# EAGLE design RS485-LoRa Wireless Station V1.3 (EAGLE 6.1)
COMPANY: ADAFRUIT INDUSTRIES; DRAWN: KTOWN; REV: B
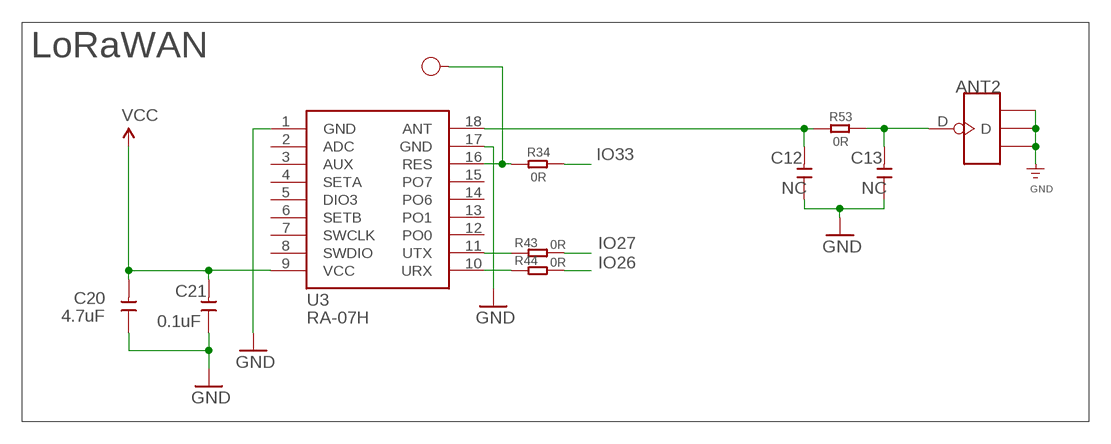
[diagram p0: schematic, sheet 1, part 1 of 3]
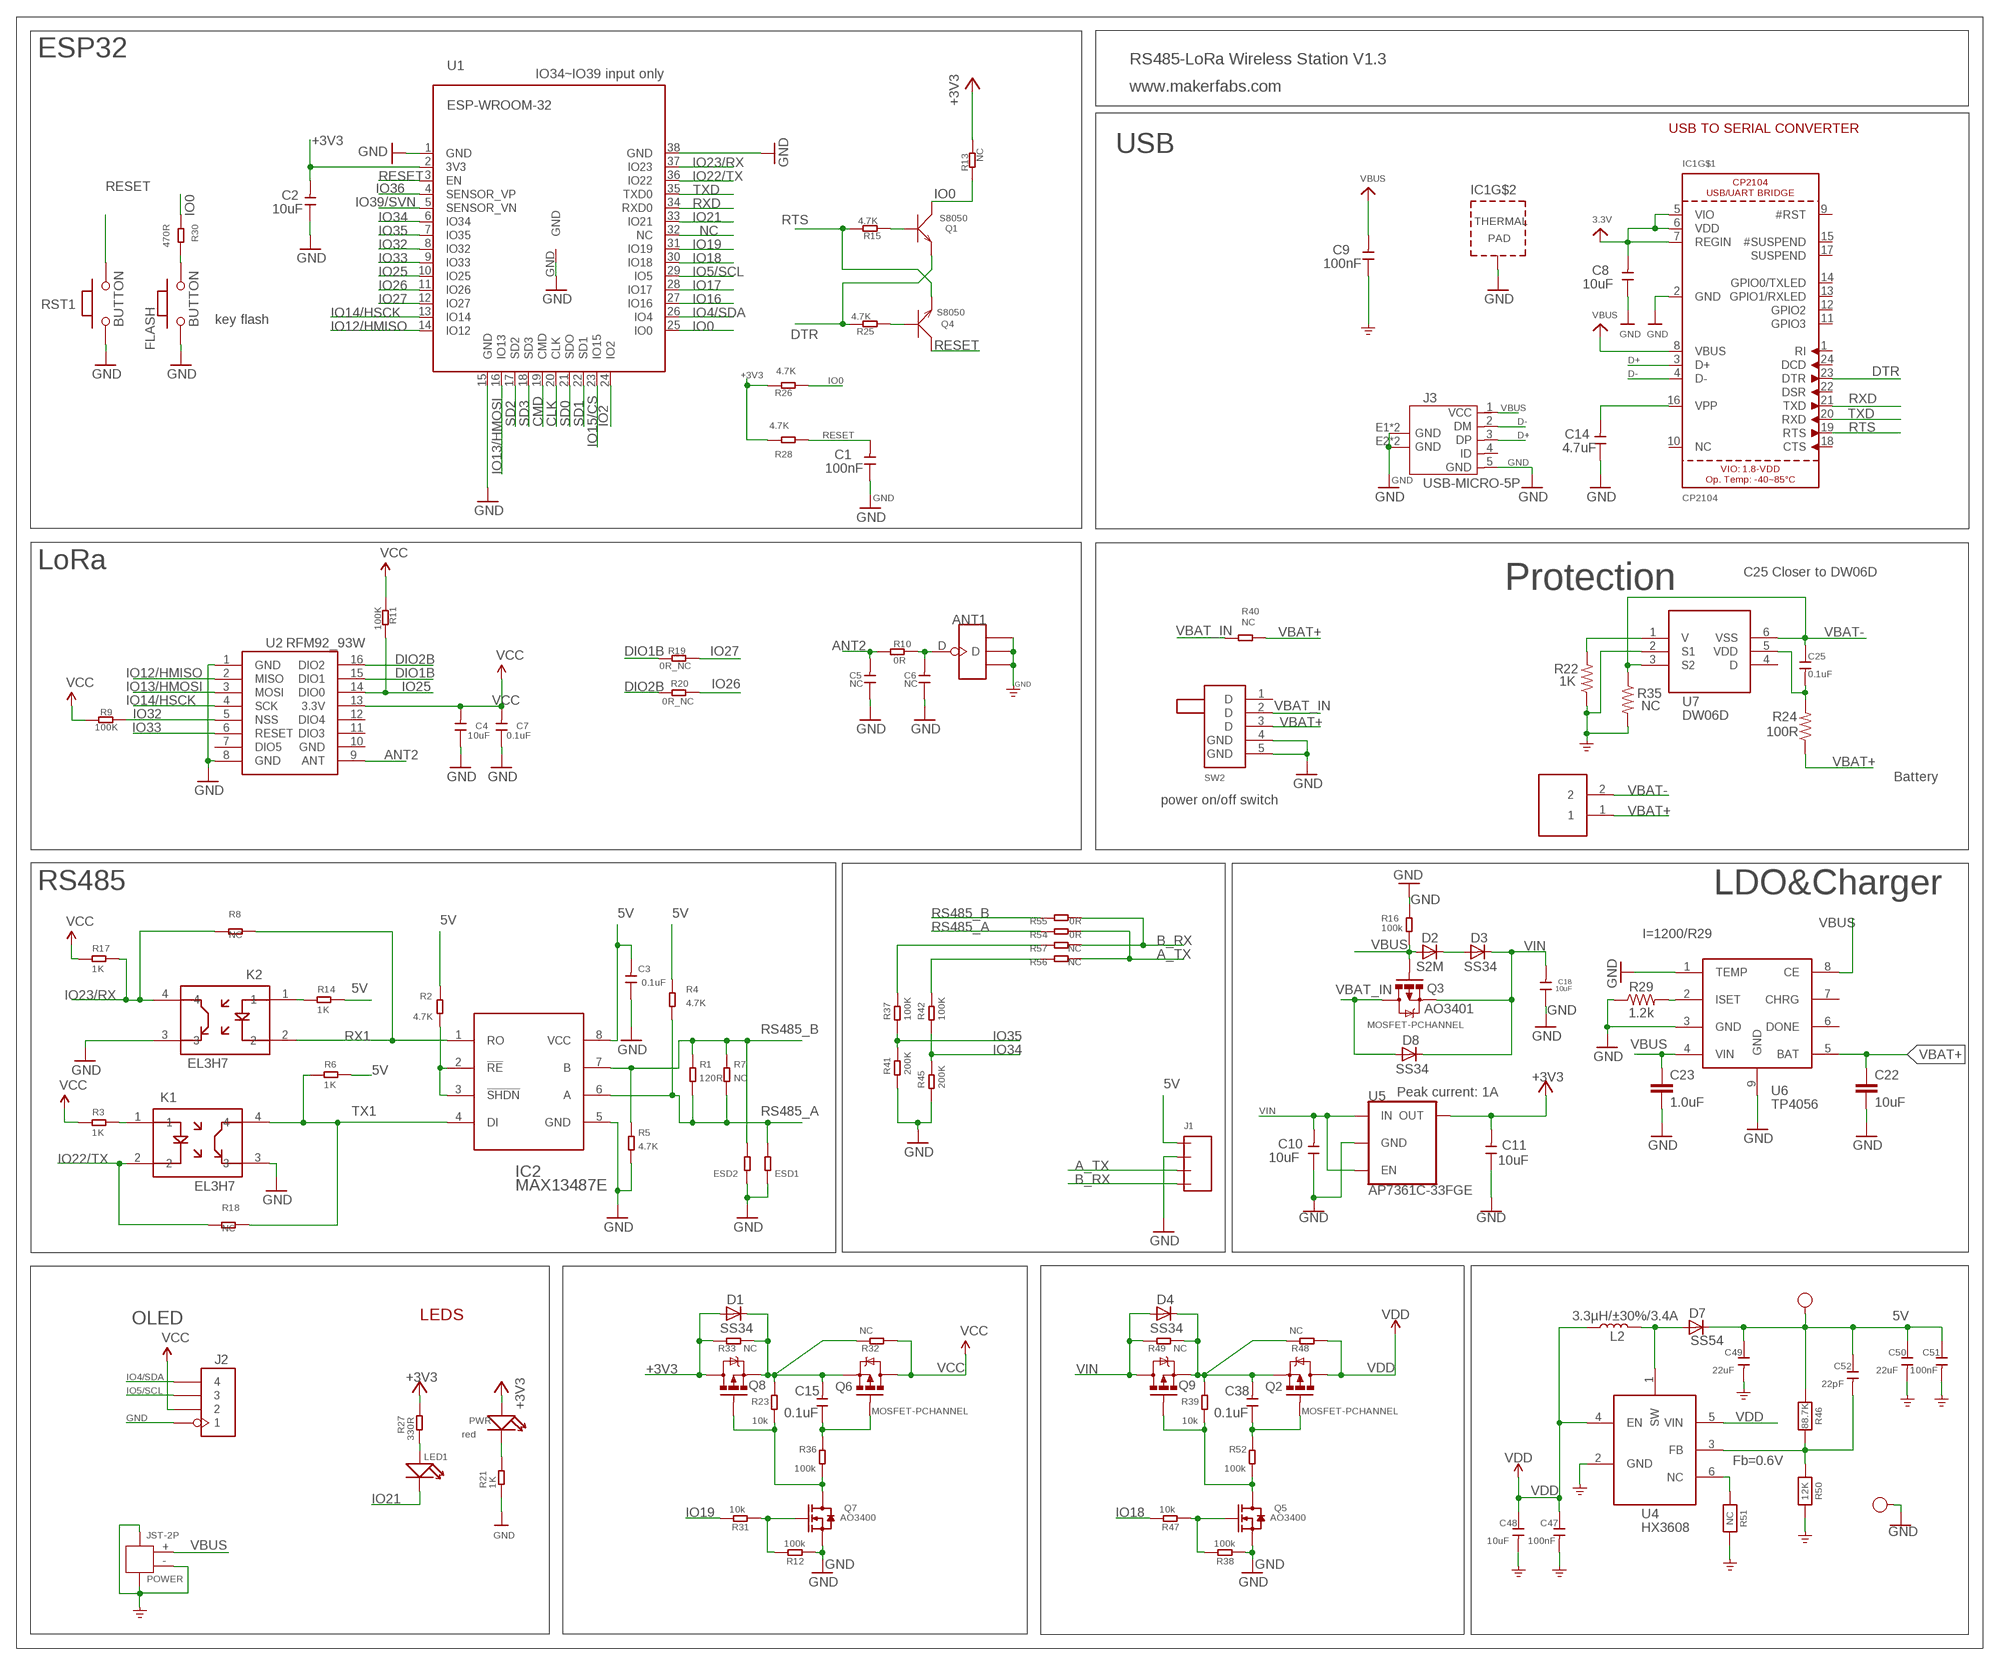
[diagram p1: schematic, sheet 1, part 2 of 3]
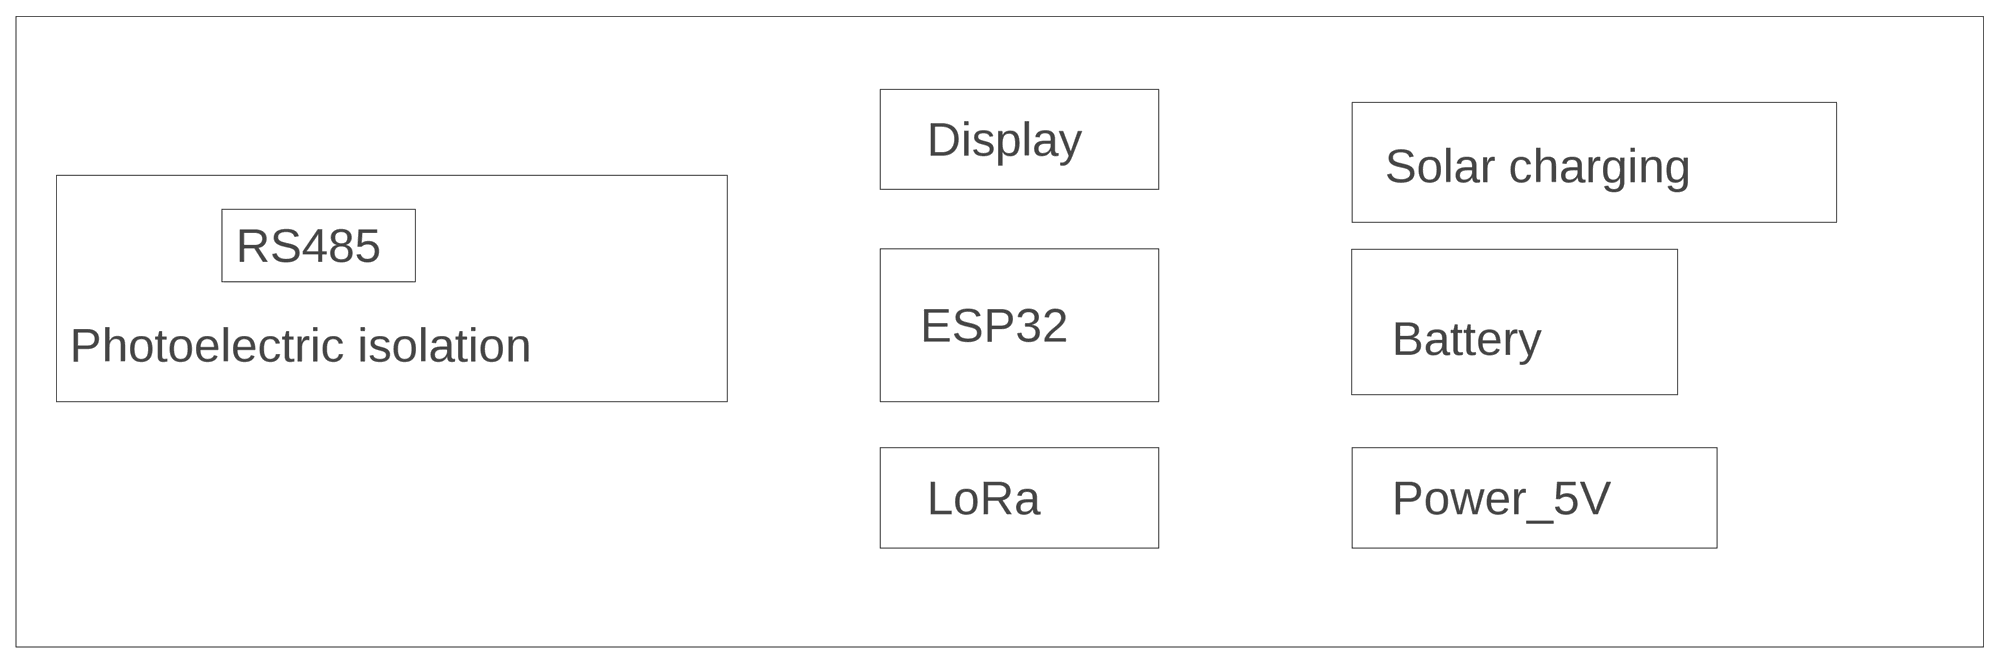
[diagram p2: schematic, sheet 1, part 3 of 3]

## Parts
5V  TEST-POINT'4545'  [TP-D45MIL]
ANT1  ANTENNA-U-FL  [4P-U-FL]
ANT2  ANTENNA-U-FL  [4P-U-FL]
C1  100nF  C-0603  [C0603]
C2  10uF  C-0603  [C0603]
C3  0.1uF  C-0603  [C0603]
C4  10uF  C-0603  [C0603]
C5  NC  DISCRETE_C-0603  [DISCRETE_C0603]
C6  NC  DISCRETE_C-0603  [DISCRETE_C0603]
C7  0.1uF  C-0603  [C0603]
C8  10uF  C-0603  [C0603]
C9  100nF  C-0603  [C0603]
C10  10uF  C-0603  [C0603]
C11  10uF  C-0603  [C0603]
C12  NC  C-0603  [C0603]
C13  NC  C-0603  [C0603]
C14  4.7uF  C-0603  [C0603]
C15  0.1uF  C-0603  [C0603]
C18  10uF  C-0603  [C0603]
C20  4.7uF  C-0603  [C0603]
C21  0.1uF  C-0603  [C0603]
C22  10uF  10UF-1206-6.3V-20%  [1206]
C23  1.0uF  1.0UF-0603-16V-10%  [0603]
C25  0.1uF  C-0603  [C0603]
C38  0.1uF  C-0603  [C0603]
C47  100nF  CAP-0603  [C0603]
C48  10uF  CAP-0603  [C0603]
C49  22uF  CAP-0603  [C0603]
C50  22uF  CAP-0603  [C0603]
C51  100nF  CAP-0603  [C0603]
C52  22pF  CAP-0603  [C0603]
D1  SS34  DIODE-DO-214AC  [DO-214AC]
D2  S2M  DIODE-DO-214AC  [DO-214AC]
D3  SS34  DIODE-DO-214AC  [DO-214AC]
D4  SS34  DIODE-DO-214AC  [DO-214AC]
D7  SS54  DIODE-DO-214AC  [DO-214AC]
D8  SS34  DIODE-DO-214AC  [DO-214AC]
ESD1  R-0603  [R0603]
ESD2  R-0603  [R0603]
FLASH  BUTTON  PB157  [157SW]
GND  TEST-POINT'4545'  [TP-D45MIL]
IC1  CP2104  [QFN24_4MM_SMSC]
IC2  MAX13487E  [DIP8_MAX13487]
J1  J_4P_5.08  [DIP4_5.08]
J2  HEADER-1X4P  [SMD4-2.54P]
J3  USB-MICRO-5P  [MICRO-USB-5P]
J5  PH2.0-2P-90-DIP  [PH2.0-2P-90-DIP]
K1  EL3H7  [SOP-4_P1.27]
K2  EL3H7  [SOP-4_P1.27]
L2  3.3µH/±30%/3.4A  INDUCTOR-CR54-3.3UH  [CR54]
LED1  DISCRETE_LED0603  [DISCRETE_LED-0603]
POWER  JST-2P  JST-2P-SMD'2.0'  [HW2-SMD-2.0-90D]
PWR  red  LED'0603'  [LED-0603]
Q1  S8050  TRANSISTOR-NPN-SOT23  [SOT23]
Q2  MOSFET-PCHANNEL  [SOT23-3]
Q3  MOSFET-PCHANNEL  [SOT23-3]
Q4  S8050  TRANSISTOR-NPN-SOT23  [SOT23]
Q5  AO3400  MOSFET-N'SOT23'  [SOT23@1]
Q6  MOSFET-PCHANNEL  [SOT23-3]
Q7  AO3400  MOSFET-N'SOT23'  [SOT23@1]
Q8  MOSFET-PCHANNEL  [SOT23-3]
Q9  MOSFET-PCHANNEL  [SOT23-3]
R1  120R  R-0603  [R0603]
R2  4.7K  R-0603  [R0603]
R3  1K  R-0603  [R0603]
R4  4.7K  R-0603  [R0603]
R5  4.7K  R-0603  [R0603]
R6  1K  R-0603  [R0603]
R7  NC  R-0603  [R0603]
R8  NC  R-0603  [R0603]
R9  100K  R-0603  [R0603]
R10  0R  DISCRETE_R-0603  [DISCRETE_R0603]
R11  100K  R-0603  [R0603]
R12  100k  R-0603  [R0603]
R13  NC  R-0603  [R0603]
R14  1K  R-0603  [R0603]
R15  4.7K  R-0603  [R0603]
R16  100k  R-0603  [R0603]
R17  1K  R-0603  [R0603]
R18  NC  R-0603  [R0603]
R19  0R_NC  R-0603  [R0603]
R20  0R_NC  R-0603  [R0603]
R21  1K  R-0603  [R0603]
R22  1K  10KOHM-0603-1/10W-1%  [0603]
R23  10k  R-0603  [R0603]
R24  100R  10KOHM-0603-1/10W-1%  [0603]
R25  4.7K  R-0603  [R0603]
R26  4.7K  R-0603  [R0603]
R27  330R  R-0603  [R0603]
R28  4.7K  R-0603  [R0603]
R29  1.2k  2.49KOHM-0603-1/10W-1%  [0603]
R30  470R  R-0603  [R0603]
R31  10k  R-0603  [R0603]
R32  NC  R-0603  [R0603]
R33  NC  R-0603  [R0603]
R34  0R  R-0603  [R0603]
R35  NC  10KOHM-0603-1/10W-1%  [0603]
R36  100k  R-0603  [R0603]
R37  100K  R-0603  [R0603]
R38  100k  R-0603  [R0603]
R39  10k  R-0603  [R0603]
R40  NC  R-0603  [R0603]
R41  200K  R-0603  [R0603]
R42  100K  R-0603  [R0603]
R43  0R  R-0603  [R0603]
R44  0R  R-0603  [R0603]
R45  200K  R-0603  [R0603]
R46  88.7K  RESISTOR_0603_NOOUT  [0603-NO]
R47  10k  R-0603  [R0603]
R48  NC  R-0603  [R0603]
R49  NC  R-0603  [R0603]
R50  12K  RESISTOR_0603_NOOUT  [0603-NO]
R51  NC  RESISTOR_0603_NOOUT  [0603-NO]
R52  100k  R-0603  [R0603]
R53  0R  R-0603  [R0603]
R54  0R  R-0603  [R0603]
R55  0R  R-0603  [R0603]
R56  NC  R-0603  [R0603]
R57  NC  R-0603  [R0603]
RES  TEST-POINT'4545'  [TP-D45MIL]
RST1  BUTTON  PB157  [157SW]
SW2  SWITCH  [DIP5-8.6*4.5MM]
U1  ESP-WROOM-32  [ESP-WROOM-32]
U2  RFM92_93W  [RFM92_93W]
U3  RA-07H  [SMD18-127P-1600L1600W]
U4  HX3608  [SOT-23-6]
U5  AP7361C-33FGE  [8-UDFN]
U6  TP4056  [SOP8-1.27P]
U7  DW06D  [SOT-23-6]

## Nets
5V: 5V.T C3.2 C49.1 C50.1 C51.1 C52.1 D7.C IC2.8(VCC) J1.P$1 R2.2 R4.2 R6.1 R14.1 R46.1
+3V3: C2.2 C8.2 C11.2 D1.A IC1.5(VIO) IC1.6(VDD) IC1.7(REGIN) PWR.+ Q8.3(D) R13.1 R26.1 R27.2 R28.1 R33.2 U1.2(3V3) U5.1(OUT) ; supply symbol labelled 3.3V
A_TX: J1.P$3 R54.1 R56.1
ANT2: C5.2 R10.1 U2.9(ANT)
B_RX: J1.P$4 R55.1 R57.1
CLK: U1.20(CLK)
CMD: U1.19(CMD)
D+: IC1.3(D+) J3.3(DP)
D-: IC1.4(D-) J3.2(DM)
DIO1B: R19.2 U2.15(DIO1)
DIO2B: R20.2 U2.16(DIO2)
DTR: IC1.23(DTR) Q1.2(E) R25.1
GND: ANT1.GND1 ANT1.GND2 ANT1.GND3 ANT2.GND1 ANT2.GND2 ANT2.GND3 C1.1 C2.1 C3.1 C4.1 C5.1 C6.1 C7.1 C8.1 C9.1 C10.1 C11.1 C12.1 C13.1 C14.1 C18.1 C20.1 C21.1 C22.2 C23.2 C47.2 C48.2 C49.2 C50.2 C51.2 ESD1.1 ESD2.1 FLASH.1 GND.T IC1.2(GND) IC1.THERM(TP) IC2.5(GND) J1.P$2 J2.1 J3.5(GND) J3.E1(GND) J3.E2(GND) J3.P1(GND) J3.P2(GND) K1.3 K2.3 POWER.3 POWER.4 POWER.- Q5.2(S) Q7.2(S) R5.1 R12.1 R16.2 R21.1 R22.1 R29.1 R35.2 R38.1 R41.2 R45.2 R50.2 R51.2 RST1.1 SW2.4(GND) SW2.5(GND) U1.1(GND) U1.15(GND) U1.38(GND) U1.GND U2.1(GND) U2.8(GND) U3.1(GND) U3.17(GND) U4.2(GND) U5.4(GND) U5.EP(GND) U6.1(TEMP) U6.3(GND) U6.9(GND) U7.2(S1)
IO0: Q1.3(C) R13.2 R26.2 R30.2 U1.25(IO0)
IO2: U1.24(IO2)
IO4/SDA: J2.4 U1.26(IO4)
IO5/SCL: J2.3 U1.29(IO5)
IO12/HMISO: U1.14(IO12) U2.2(MISO)
IO13/HMOSI: U1.16(IO13) U2.3(MOSI)
IO14/HSCK: U1.13(IO14) U2.4(SCK)
IO15/CS: U1.23(IO15)
IO16: U1.27(IO16)
IO17: U1.28(IO17)
IO18: R47.2 U1.30(IO18)
IO19: R31.2 U1.31(IO19)
IO21: LED1.- U1.33(IO21)
IO22/TX: K1.2 R18.2 U1.36(IO22)
IO23/RX: K2.4 R8.2 R17.1 U1.37(IO23)
IO25: R11.1 U1.10(IO25) U2.14(DIO0)
IO26: R20.1 R44.2 U1.11(IO26)
IO27: R19.1 R43.2 U1.12(IO27)
IO32: R9.1 U1.8(IO32) U2.5(NSS)
IO33: R34.2 U1.9(IO33) U2.6(RESET)
IO34: R42.2 R45.1 U1.6(IO34)
IO35: R37.2 R41.1 U1.7(IO35)
IO36: U1.4(SENSOR_VP)
IO39/SVN: U1.5(SENSOR_VN)
ISET: R29.2 U6.2(ISET)
N$1: K2.1 R14.2
N$2: D2.C D3.A
N$3: K1.1 R3.1
N$4: ANT1.D C6.2 R10.2
N$5: LED1.+ R27.1
N$6: C14.2 IC1.16(VPP)
N$7: PWR.- R21.2
N$8: Q4.1(B) R25.2
N$9: Q1.1(B) R15.2
N$10: FLASH.2 R30.1
N$11: C38.1 Q2.1(G) R52.2
N$12: Q5.1(G) R38.2 R47.1
N$13: C15.1 Q6.1(G) R36.2
N$14: Q7.1(G) R12.2 R31.1
N$15: C15.2 D1.C Q6.2(S) Q8.2(S) R23.2 R32.2 R33.1
N$16: C25.2 R24.2 U7.5(VDD)
N$17: R22.2 U7.1(V)
N$18: Q7.3(D) Q8.1(G) R23.1 R36.1
N$19: R42.1 R56.2
N$20: C38.2 D4.C Q2.2(S) Q9.2(S) R39.2 R48.2 R49.1
N$21: R37.1 R57.2
N$22: R43.1 U3.11(UTX)
N$23: D7.A L2.P$2 U4.1(SW)
N$24: R44.1 U3.10(URX)
N$25: C52.2 R46.2 R50.1 U4.3(FB)
N$26: R51.1 U4.6(NC)
N$27: R34.1 RES.T U3.16(RES)
N$28: C12.2 R53.1 U3.18(ANT)
N$29: ANT2.D C13.2 R53.2
N$31: Q5.3(D) Q9.1(G) R39.1 R52.1
N$36: IC2.2(!RE) IC2.3(!SHDN) R2.1
NC: U1.32(NC)
RESET: C1.2 Q4.3(C) R28.2 RST1.2 U1.3(EN)
RS485_A: ESD1.2 IC2.6(A) R1.1 R4.1 R7.1 R54.2
RS485_B: ESD2.2 IC2.7(B) R1.2 R5.2 R7.2 R55.2
RTS: IC1.19(RTS) Q4.2(E) R15.1
RX1: IC2.1(RO) K2.2 R8.1
RXD: IC1.21(TXD) U1.34(RXD0)
SD0: U1.21(SDO)
SD1: U1.22(SD1)
SD2: U1.17(SD2)
SD3: U1.18(SD3)
TX1: IC2.4(DI) K1.4 R6.2 R18.1
TXD: IC1.20(RXD) U1.35(TXD0)
VBAT+: C22.1 J5.1 R24.1 R40.2 SW2.3(D) U6.5(BAT)
VBAT-: C25.1 J5.2 R35.1 U7.3(S2) U7.6(VSS)
VBAT_IN: D8.A Q3.3(D) R40.1 SW2.2(D)
VBUS: C9.2 C23.1 D2.A IC1.8(VBUS) J3.1(VCC) POWER.+ Q3.1(G) R16.1 U6.4(VIN) U6.8(CE)
VCC: C4.2 C7.2 C20.2 C21.2 J2.2 Q6.3(D) R3.2 R9.2 R11.2 R17.2 R32.1 U2.13(3.3V) U3.9(VCC)
VDD: C47.1 C48.1 L2.P$1 Q2.3(D) R48.1 U4.4(EN) U4.5(VIN)
VIN: C10.2 C18.2 D3.C D4.A D8.C Q3.2(S) Q9.3(D) R49.2 U5.5(EN) U5.8(IN)
Unconnected: IC1.1(RI) IC1.9(#RST) IC1.10(NC) IC1.11(GPIO3) IC1.12(GPIO2) IC1.13(GPIO1/RXLED) IC1.14(GPIO0/TXLED) IC1.15(#SUSPEND) IC1.17(SUSPEND) IC1.18(CTS) IC1.22(DSR) IC1.24(DCD) J3.4(ID) SW2.1(D) U2.7(DIO5) U2.11(DIO3) U2.12(DIO4) U3.2(ADC) U3.3(AUX) U3.4(SETA) U3.5(DIO3) U3.6(SETB) U3.7(SWCLK) U3.8(SWDIO) U3.12(PO0) U3.13(PO1) U3.14(PO6) U3.15(PO7) U6.6(DONE) U6.7(CHRG) U7.4(D)

## Notes on the sheet
- ESP32
- RS485-LoRa Wireless Station V1.3
- IO34~IO39 input only
- www.makerfabs.com
- USB TO SERIAL CONVERTER
- USB
- Display
- Solar charging
- key flash
- RS485
- ESP32 | Battery
- Photoelectric isolation
- LoRaWAN | LoRa
- C25 Closer to DW06D
- Protection
- LoRa | Power_5V
- Battery
- power on/off switch
- RS485 | LDO&Charger
- I=1200/R29
- AO3401
- Peak current: 1A
- OLED | LEDS
- Fb=0.6V

## Power pins joined to a net without a drawn wire
GND: U2.10(GND)

## Library data of the parts
5V GND RES = Discrete-new:TEST-POINT; PARTNO: DNP
ANT1 ANT2 = Connector:ANTENNA-U-FL
C1-C4 C7-C15 C18 C20 C21 C25 C38 = Discrete:C*: Ceramic Capacitors
C5 C6 = A9G:DISCRETE_C*: Ceramic Capacitors
C22 = SparkFun-Capacitors:10UF: 10.0µF ceramic capacitors A capacitor is a passive two-terminal electrical component used to store electrical energy temporarily in an electric field.; PROD_ID: CAP-10057
C23 = SparkFun-Capacitors:1.0UF: 1µF ceramic capacitors A capacitor is a passive two-terminal electrical component used to store electrical energy temporarily in an electric field.; PROD_ID: CAP-00868
C47-C52 = Discrete-new:CAP: Ceramic Capacitors
D1-D4 D7 D8 = diode:DIODE-: DIODE
ESD1 ESD2 R1-R9 R11-R21 R23 R25-R28 R30-R34 R36-R45 R47-R49 R52-R57 = Discrete:R*
FLASH RST1 = MySMD:PB157
IC1 = microbuilder:CP2104: CP2104 - USB to UART Bridge VDD Output: 3.45V
IC2 = 1mytest:MAX13487E
J1 = 1mytest:J_4P_5.08
J2 = self:HEADER-1X4P
J3 = Connector:USB-MICRO-5P
J5 = Connector:PH2.0-2P-90-DIP
K1 K2 = 1mytest:EL3H7: Optocoupler
L2 = SparkFun-Coils:INDUCTOR: Inductors Resist changes in electrical current. Basically a coil of wire. SparkFun Products: SparkFun Load Cell Amplifier - HX711 <https://www.sparkfun.com/products/13879> IOIO-OTG - V2.2 <https://www.sparkfun.com/products/13613>; PROD_ID: NDUC-11157
LED1 = A9G:DISCRETE_LED*
POWER = Connector-new:JST-2P-SMD: 2P-SMD-1.0-90D:320110054;2P-SMD-2.0-90D:320110026
PWR = Discrete:LED*
Q1 Q4 = Discrete:TRANSISTOR-NPN*: NPN audion
Q2 Q3 Q6 Q8 Q9 = User-Submitted:MOSFET-PCHANNEL: Generic PMOSFET IRLML2244 - TRANS-11153 (SOT-23 -20V -4.3A) (1.Gate 2.Source 3.Drain) FQP27P06 - COM-10349 <http://www.sparkfun.com/products/10349> (TO-220 -60V -27A) (1.Gate 2.Source 3.Drain); PROD_ID: TRANS-08285
Q5 Q7 = Discrete:MOSFET-N: IRLL014: http://www.vishay.com/docs/91319/sihll014.pdf
R10 = A9G:DISCRETE_R*
R22 R24 R35 = SparkFun-Resistors:10KOHM: 10kΩ resistor A resistor is a passive two-terminal electrical component that implements electrical resistance as a circuit element. Resistors act to reduce current flow, and, at the same time, act to lower voltage levels within circuits.; PROD_ID: RES-00824; VALUE: 10k
R29 = SparkFun-Resistors:2.49KOHM: 2.49kΩ resistor A resistor is a passive two-terminal electrical component that implements electrical resistance as a circuit element. Resistors act to reduce current flow, and, at the same time, act to lower voltage levels within circuits. - Wikipedia; PROD_ID: RES-09568; VALUE: 2.49k
R46 R50 R51 = microbuilder:RESISTOR: Resistors For new designs, use the packages preceded by an '_' character since they are more reliable: The following footprints should be used on most boards: _0402 - Standard footprint for regular board layouts _0603 - Standard footprint for regular board layouts _0805 - Standard footprint for regular board layouts _1206 - Standard footprint for regular board layouts For extremely tight-pitch boards where space is at a premium, the following 'micro-pitch' footprints can be used (smaller pads, no silkscreen outline, etc.): _0402MP - Micro-pitch footprint for very dense/compact boards _0603MP - Micro-pitch footprint for very dense/compact boards _0805MP - Micro-pitch footprint for very dense/compact boards _1206MP - Micro-pitch footprint for very dense/compact boards
SW2 = self:SWITCH
U1 = esp32:ESP-WROOM-32
U2 = dragino:RFM92_93W
U3 = self:RA-07H
U4 = self:HX3608
U5 = ublox:AP7361C-33FGE: AP7361C 3.3V LDO Regulator; PROD_ID: VREG-14094
U6 = self:TP4056
U7 = self:DW06D

## Net classes
0 default: width 0.203 mm, drill 0.305 mm, clearance 0.152 mm

## Board
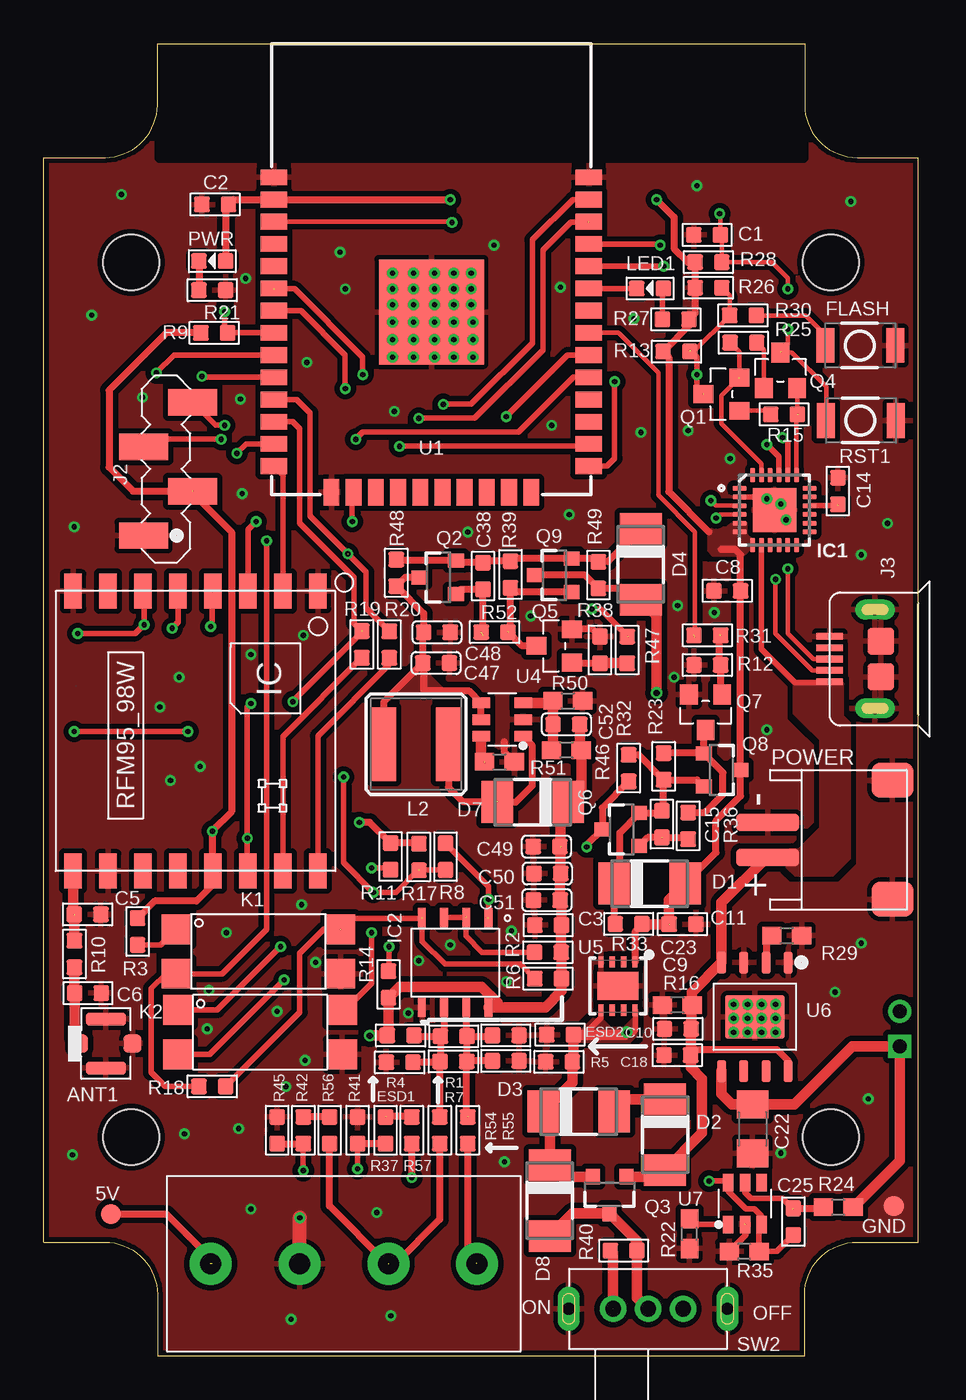
[diagram p3: board, top side]
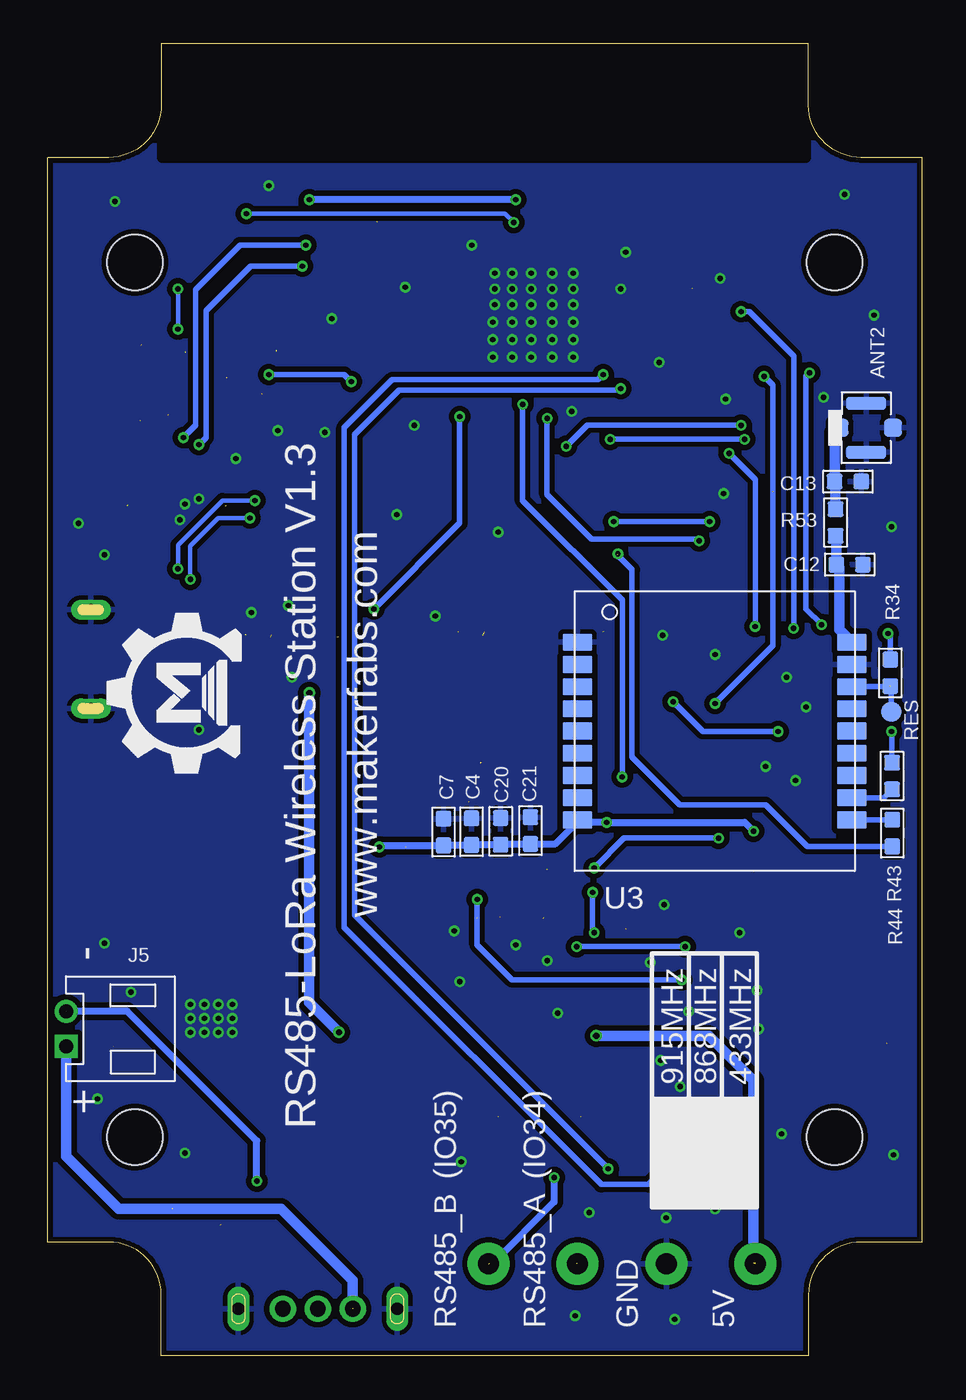
[diagram p4: board, bottom side, seen from below]

Size 50 x 75 mm. Coordinates in mm from the lower left corner, seen from the top.
Outline: 50,6.5 50,68.5 46.5,68.5 arc-90 43.5,71.5 43.5,75 6.5,75 6.5,71.5 arc-90 3.5,68.5 0,68.5 0,6.5 3.5,6.5 arc-90 6.5,3.5 6.5,0 43.5,0 43.5,3.5 arc-90 46.5,6.5 50,6.5
Copper layers (1*16): Top 0.035mm / dielectric 1.5mm / Bottom 0.035mm
Design rules: minimum track width 6mil, minimum drill 12mil, track to track 8mil, track to pad 8mil, pad to pad 8mil, via to via 8mil, smd to smd 0mil, copper to edge 10mil, drill to drill 10mil, minimum pad ring 10mil, minimum via ring 6mil, stop-mask expansion 2mil, vias tented up to drill 100mil, thermal gap 10mil
Holes 3.2 mm at 5,12.5 45,12.5 5,62.5 45,62.5
tRestrict: area 6.6,68.5 to 43.4,75.6
bRestrict: area 6.6,68.5 to 43.4,75.6

### Footprints (pad centres in the part's own frame; a part is rotated, then mirrored left to right if it is on the bottom)
TP-D45MIL = smd 1.143 x 1.143: T 0,0
4P-U-FL = smd 1.016 x 1.016: D -1.524,0; GND3 1.524,0 | smd 2.286 x 0.762: GND1 0,1.397; GND2 0,-1.397
C0603 = smd 0.889 x 0.889: 1 -0.762,0; 2 0.762,0
DISCRETE_C0603 = smd 0.889 x 0.889: 1 -0.762,0; 2 0.762,0
1206 = smd 1.6 x 1.8: 1 -1.4,0; 2 1.4,0
0603 = smd 1.1 x 1: 1 -0.85,0; 2 0.85,0
C0603' = smd 0.889 x 0.889: 1 0,0.762; 2 0,-0.762
DO-214AC = smd 1.8 x 2.4: A 2.025,0; C -2.025,0
R0603 = smd 0.889 x 0.889: 1 -0.762,0; 2 0.762,0
157SW = smd 1.016 x 1.981: 1 0,0; 2 4,0
QFN24_4MM_SMSC = smd 0.8 x 0.28: 1 -2,1.25; 2 -2,0.75; 3 -2,0.25; 4 -2,-0.25; 5 -2,-0.75; 6 -2,-1.25; 13 2,-1.25; 14 2,-0.75; 15 2,-0.25; 16 2,0.25; 17 2,0.75; 18 2,1.25 | smd 0.28 x 0.8: 7 -1.25,-2; 8 -0.75,-2; 9 -0.25,-2; 10 0.25,-2; 11 0.75,-2; 12 1.25,-2; 19 1.25,2; 20 0.75,2; 21 0.25,2; 22 -0.25,2; 23 -0.75,2; 24 -1.25,2 | smd 2.5 x 2.5: THERM 0,0
DIP8_MAX13487 = smd 1.1 x 0.45: 1 1.27,3.81; 2 1.27,2.54; 3 1.27,1.27; 4 1.27,0; 5 6.39,0; 6 6.39,1.27; 7 6.39,2.54; 8 6.39,3.81
DIP4_5.08 = drill 1.2 pad 2.4: P$1 0,0; P$2 5.08,0; P$3 10.16,0; P$4 15.24,0
SMD4-2.54P = smd 1.5 x 2.8: 1 -3.81,1.4; 2 -1.27,-1.4; 3 1.27,1.4; 4 3.81,-1.4
MICRO-USB-5P = smd 0.38 x 1.52: 1 -1.3,0; 2 -0.65,0; 3 0,0; 4 0.65,0; 5 1.3,0 | smd 1.524 x 1.524: E1 -1.016,-2.921; E2 1.016,-2.921 | drill 0.635 pad 1.143 long: P1 -2.819,-2.591; P2 2.819,-2.591
PH2.0-2P-90-DIP = drill 0.8 square: 1 0,1 | drill 0.8: 2 0,-1
SOP-4_P1.27 = smd 1.68 x 1.71: 1 0,2.54; 2 0,0; 3 9.39,0; 4 9.39,2.54
CR54 = smd 4.2 x 1.4: P$1 0,1.85; P$2 0,-1.85
DISCRETE_LED-0603 = smd 0.889 x 0.889: + -0.762,0; - 0.762,0
HW2-SMD-2.0-90D = smd 2 x 2.4: 3 3.4,-2.181; 4 -3.4,-2.181 | smd 1 x 3.6: + -1,4.953; - 1,4.953
LED-0603 = smd 0.889 x 0.889: + -0.762,0; - 0.762,0
SOT23 = smd 1.016 x 1.143: 1 -0.95,-1.016; 2 0.95,-1.016; 3 0,1.016
SOT23-3 = smd 0.8 x 0.9: 1 -0.95,-1; 2 0.95,-1; 3 0,1.1
SOT23@1 = smd 1.016 x 1.143: 1 -0.95,-1.016; 2 0.95,-1.016; 3 0,1.016
DISCRETE_R0603 = smd 0.889 x 0.889: 1 -0.762,0; 2 0.762,0
0603-NO = smd 1.1 x 1: 1 -0.85,0; 2 0.85,0
DIP5-8.6*4.5MM = drill 0.9 pad 1.5: 1 -2,0; 2 0,0; 3 2,0 | drill 0.7 pad 1.27 long: 4 -4.54,0; 5 4.54,0
ESP-WROOM-32 = smd 0.9 x 1.5: 1 7.7,9; 2 6.43,9; 3 5.16,9; 4 3.89,9; 5 2.62,9; 6 1.35,9; 7 0.08,9; 8 -1.19,9; 9 -2.46,9; 10 -3.73,9; 11 -5,9; 12 -6.27,9; 13 -7.54,9; 14 -8.81,9; 25 -8.81,-9; 26 -7.54,-9; 27 -6.27,-9; 28 -5,-9; 29 -3.73,-9; 30 -2.46,-9; 31 -1.19,-9; 32 0.08,-9; 33 1.35,-9; 34 2.62,-9; 35 3.89,-9; 36 5.16,-9; 37 6.43,-9; 38 7.7,-9 | smd 1.5 x 0.9: 15 -10.3,5.715; 16 -10.3,4.445; 17 -10.3,3.175; 18 -10.3,1.905; 19 -10.3,0.635; 20 -10.3,-0.635; 21 -10.3,-1.905; 22 -10.3,-3.175; 23 -10.3,-4.445; 24 -10.3,-5.715 | smd 6 x 6: GND 0,0
RFM92_93W = smd 2 x 1: 1 -8,7; 2 -8,5; 3 -8,3; 4 -8,1; 5 -8,-1; 6 -8,-3; 7 -8,-5; 8 -8,-7; 9 8,-7; 10 8,-5; 11 8,-3; 12 8,-1; 13 8,1; 14 8,3; 15 8,5; 16 8,7
SMD18-127P-1600L1600W = smd 1.7 x 1: 1 -7.85,5.08; 2 -7.85,3.81; 3 -7.85,2.54; 4 -7.85,1.27; 5 -7.85,0; 6 -7.85,-1.27; 7 -7.85,-2.54; 8 -7.85,-3.81; 9 -7.85,-5.08; 10 7.85,-5.08; 11 7.85,-3.81; 12 7.85,-2.54; 13 7.85,-1.27; 14 7.85,0; 15 7.85,1.27; 16 7.85,2.54; 17 7.85,3.81; 18 7.85,5.08
SOT-23-6 = smd 1 x 0.6: 1 -1.2,0.95; 2 -1.2,0; 3 -1.2,-0.95; 4 1.2,-0.95; 5 1.2,0; 6 1.2,0.95
8-UDFN = smd 0.3 x 0.65: 1 -0.975,-1.375; 2 -0.325,-1.375; 3 0.325,-1.375; 4 0.975,-1.375; 5 0.975,1.375; 6 0.325,1.375; 7 -0.325,1.375; 8 -0.975,1.375 | smd 2.35 x 1.6: EP 0,0
SOP8-1.27P = smd 1.27 x 0.51: 1 -3.1,1.905; 2 -3.1,0.635; 3 -3.1,-0.635; 4 -3.1,-1.905; 5 3.1,-1.905; 6 3.1,-0.635; 7 3.1,0.635; 8 3.1,1.905 | smd 2.5 x 3.4: 9 0,0

### Placement (x,y rotation side)
5V  3.83,8.1 0 top
ANT1  3.55,17.85 0 top
ANT2  3.2,53.05 0 bottom
C1  37.93,64.07 0 top
C2  9.8,65.81 0 top
C3  28.84,24.62 0 top
C4  25.76,29.96 270 bottom
C5  2.51,25.23 180 top
C6  2.53,20.73 180 top
C7  27.36,29.94 270 bottom
C8  39.08,43.72 0 top
C9  36.25,18.69 0 top
C10  29.52,18.36 0 top
C11  36.52,24.67 180 top
C12  4.14,45.22 180 bottom
C13  4.24,49.98 180 bottom
C14  45.41,49.43 270 top
C15  35.34,30.39 90 top
C18  29.46,16.81 0 top
C20  24.1,29.98 270 bottom
C21  22.4,30.02 270 bottom
C22  40.52,12.98 270 top
C23  36.22,20.06 180 top
C25  42.86,7.67 90 top
C38  25.12,44.57 90 top
C47  100nF  [C0603']  22.43,39.6 90 top
C48  10uF  [C0603']  22.48,41.35 90 top
C49  22uF  [C0603']  28.74,29.11 270 top
C50  22uF  [C0603']  28.79,27.56 270 top
C51  100nF  [C0603']  28.76,26.04 270 top
C52  22pF  [C0603']  29.88,36.09 270 top
D1  34.64,26.99 0 top
D2  35.52,12.64 270 top
D3  30.58,13.96 0 top
D4  34.13,45.24 270 top
D7  27.95,31.65 180 top
D8  28.94,8.87 270 top
ESD1  20.35,16.78 0 top
ESD2  26.42,18.31 180 top
FLASH  48.68,57.75 180 top
GND  48.6,8.56 0 top
IC1  41.78,48.34 0 top
IC2  21.62,26.32 270 top
J1  9.54,5.26 0 top
J2  7.11,50.69 90 top
J3  44.93,39.83 90 top
J5  48.94,18.69 180 bottom
K1  7.58,21.84 0 top
K2  7.67,17.23 0 top
L2  21.29,34.97 90 top
LED1  34.66,61.01 180 top
POWER  46.34,29.49 90 top
PWR  9.63,62.58 180 top
Q1  38.74,54.97 90 top
Q2  22.57,44.5 90 top
Q3  32.36,9.24 180 top
Q4  42.12,56.33 0 top
Q5  29.19,40.58 90 top
Q6  33.04,30.09 90 top
Q7  37.84,36.79 180 top
Q8  38.74,33.49 270 top
Q9  29.19,44.62 90 top
R1  23.44,18.26 0 top
R2  28.82,23.06 0 top
R3  5.37,24.25 90 top
R4  20.4,18.31 180 top
R5  26.42,16.86 180 top
R6  28.84,21.56 180 top
R7  23.42,16.82 0 top
R8  22.97,28.53 270 top
R9  9.75,58.47 180 top
R10  1.76,22.97 270 top
R11  19.82,28.54 90 top
R12  37.94,39.49 0 top
R13  36.18,57.41 0 top
R14  19.71,21.23 90 top
R15  42.33,53.81 180 top
R16  36.22,17.18 180 top
R17  21.45,28.51 90 top
R18  9.64,15.4 180 top
R19  18.18,40.66 270 top
R20  19.76,40.66 270 top
R21  9.64,60.91 180 top
R22  36.92,6.98 90 top
R23  35.44,33.69 270 top
R24  45.43,8.49 180 top
R25  40,57.91 0 top
R26  38,61.05 0 top
R27  36.13,59.24 0 top
R28  38,62.51 0 top
R29  42.48,24.01 180 top
R30  39.98,59.47 180 top
R31  37.94,41.19 180 top
R32  33.44,33.59 90 top
R33  33.44,24.69 0 top
R34  1.82,39.04 90 bottom
R35  40.04,5.97 180 top
R36  36.84,30.29 270 top
R37  19.54,12.89 270 top
R38  31.8,40.35 270 top
R39  26.68,44.66 90 top
R40  33.16,6.02 180 top
R41  17.94,12.89 90 top
R42  14.84,12.89 270 top
R43  1.72,33.14 90 bottom
R44  1.7,29.88 270 bottom
R45  13.34,12.89 90 top
R46  29.88,34.62 180 top
R47  33.36,40.34 90 top
R48  20.16,44.76 90 top
R49  31.71,44.63 270 top
R50  29.96,37.43 0 top
R51  26.05,33.94 0 top
R52  25.78,41.37 180 top
R53  4.95,47.63 90 bottom
R54  22.64,12.89 90 top
R55  24.24,12.89 90 top
R56  16.34,12.89 90 top
R57  21.04,12.89 90 top
RES  1.76,36.82 0 bottom
RST1  48.72,53.46 180 top
SW2  34.55,2.68 180 top
U1  22.16,59.66 90 top
U2  8.68,35.71 270 top
U3  11.86,35.71 0 bottom
U4  26.2,36.37 180 top
U5  32.83,21.14 180 top
U6  40.66,19.37 270 top
U7  40.09,8.71 90 top
U$9  [MAKERFABS_0.3]  38.98,33.78 90 bottom

### Tracks (layer width: path | path; a pad name or v marks a point on that pad's centre or on a via)
5V  (via drill 0.36)  (3 unrouted)
  Top 0.406: 30.64,34.71 R46.1 | 30.73,32.41 D7.C | 5V.T 7,8.1 9.54,5.56 9.54,5.29
  Top 0.61: C52.1 30.64,34.71 | R46.1 30.73,32.41 | 25.94,19.93 28.68,19.93 29.6,20.85 R6.1 29.6,23.06 R2.2 29.58,24.62 C3.2 29.6,26.04 C51.1 29.53,27.56 C50.1 29.55,29.11 C49.1 | 25.94,19.93 IC2.8 | 25.94,19.93 25.94,20.19 25.04,21.09 20.33,21.09 R14.1 19.71,18.38 R4.2 18.67,18.31 v18.64,18.29 | D7.C 29.54,31.65 29.54,29.09
  Bottom 0.61: v18.64,18.29 12.18,18.29 9.64,15.75 9.64,5.29
+3V3  (via drill 0.3)  (1 unrouted)
  Top 0.254: C8.2 39.84,43.79
  Top 0.406: 34.37,24.69 R33.2 34.22,24.67 33.8,24.25 U5.1 | D1.A 38.44,28.76 38.44,30.59 39.84,31.99 Q8.3 | Q8.3 | R28.1 | R28.1 R26.1 37.24,59.58 R27.2 36.89,58.88 R13.1 35.74,57.08 35.74,49.39 38.04,47.09 | Q8.3 | Q8.3 39.84,43.79 39.84,45.79 39.54,46.09 38.74,46.09 | PWR.+ 10.4,65.64 C2.2 10.85,66.09 U1.2 v23.24,66.09 | v35.04,66.09 36.04,65.09 36.04,63.29 36.82,62.51 R28.1
  Top 0.61: D1.A 35.74,26.06 35.74,24.69 | C11.2 34.22,24.67
  Bottom 0.406: v23.24,66.09 v35.04,66.09
  pour Top (isolate 0.305, no thermals): 39.34,47.69 40.14,47.69 40.24,47.59 40.24,46.99 40.54,46.69 40.54,46.19 40.04,45.69 38.24,45.69 37.94,45.99 37.94,47.09 38.24,47.39 39.04,47.39
  pour Top (isolate 0.305): 36.54,62.69 36.54,59.59 36.74,59.39 37.04,59.39 37.34,59.69 37.34,62.69
A_TX  (1 unrouted)
  Top 0.406: R54.1 22.64,7.8 20.1,5.26 J1.P$3 | R56.1 16.34,8.56 19.61,5.29 19.74,5.29
ANT2  (1 unrouted)
  Top 0.61: U2.9 1.68,25.25 1.74,25.19 | C5.2 1.75,23.74 R10.1
B_RX  (via drill 0.3)  (1 unrouted)
  Top 0.406: R57.1 v21.04,10.19 | R55.1 24.24,5.8 J1.P$4
  Bottom 0.406: v21.04,10.19 21.04,8.79 24.54,5.29 24.74,5.29
D+  (via drill 0.3)  (1 unrouted)
  Top 0.254: J3.3 44,39.83 42.54,41.29 v42.54,44.99 | v38.14,48.89 38.44,48.59 39.84,48.59
  Bottom 0.254: v42.54,44.99 42.54,46.35 40,48.89 v38.14,48.89
D-  (via drill 0.3)
  Top 0.254: J3.2 43.95,39.18 41.84,41.29 v41.84,44.39 | v38.44,47.89 38.64,48.09 IC1.4
  Bottom 0.254: v41.84,44.39 41.84,46.29 40.24,47.89 v38.44,47.89
DIO1B
  Top 0.305: U2.15 13.68,35.4 R19.2
DIO2B
  Top 0.305: R20.2 19.76,39.51 15.68,35.43 U2.16
DTR  (1 unrouted)
  Top 0.254: IC1.23 41.03,51 38.74,53.29 38.74,54.89 39.74,55.89 | Q1.2 39.76,57.39 R25.1
GND  (via drill 0.3)  (1 unrouted)
  Top 0.305: IC1.2 41.64,49.09 41.74,48.99 | R35.2 40.14,6.92 40.14,7.49
  Top 0.406: R51.2 26.34,34.51 26.34,35.09 | R38.1 31.38,41.53 Q5.2
  Top 0.813: J1.P$2 14.64,5.26 v14.64,7.89
  other vias: 37.34,66.89 42.14,48.69 38.34,42.49 14.84,41.19 26.74,24.29 20.84,19.59 11.14,12.99 11.54,61.59 33.74,59.29 36.84,52.89 34.14,52.79 39.24,51.29 46.74,45.79 48.24,47.59 11.84,40.09 5.64,54.79 10.44,24.19 14.74,25.79 26.44,21.39 42.14,11.59 47.14,14.69 46.74,23.59 14.14,2.09 19.84,2.29 13.34,19.69 9.34,18.69 9.44,20.89 21.44,22.59 23.24,23.49 19.94,61.89 23.44,57.09 21.14,61.89 22.34,61.89 23.44,61.89 24.44,61.89 19.94,60.99 22.34,57.09 21.14,60.99 22.34,60.99 23.44,60.99 24.44,60.99 24.44,60.09 23.44,60.09 21.14,57.09 22.34,60.09 21.14,60.09 19.94,60.09 19.94,59.09 21.14,59.09 22.34,59.09 23.44,59.09 24.54,59.09 24.54,58.09 23.44,58.09 22.34,58.09 21.14,58.09 19.94,58.09 13.84,15.39 15.54,22.49 36.24,42.89 36.04,38.79 11.34,49.29 11.24,54.69 19.94,57.09 24.54,57.09 2.74,59.49 4.44,66.39 46.14,65.99 20.04,53.99 7.24,32.89 7.74,38.79 1.74,47.39 45.24,20.79 41.34,35.79 11.84,8.39 14.94,16.89 41.34,48.99 42.44,47.79 15.04,56.79 29.04,53.19 29.54,61.09 25.74,63.49 16.94,63.09 19.04,8.19 39.44,20.09 40.24,20.09 41.84,20.09 41.04,20.09 39.44,19.29 39.44,18.49 40.24,19.29 40.24,18.49 41.04,18.49 41.04,19.29 41.84,19.29 41.84,18.49 27.84,42.29 6.64,37.09 8.94,33.69 8.04,12.69 26.34,11.09 17.24,60.99 30.04,48.09 24.24,47.09 1.64,11.49
  pour Top (isolate 0.305, rank 6): -2.56,34.09 -2.56,75.45 -0.02,77.99 19.94,77.99 50.3,77.99 52.84,75.45 52.84,35.29 52.84,0.13 50.3,-2.41 22.84,-2.41 -0.02,-2.41 -2.56,0.13
  pour Bottom (isolate 0.305, rank 6): -2.96,33.09 -2.96,76.15 -0.42,78.69 22.24,78.69 50.9,78.69 53.44,76.15 53.44,34.49 53.44,-0.87 50.9,-3.41 22.14,-3.41 -0.42,-3.41 -2.96,-0.87
IO0  (via drill 0.3)  (2 unrouted)
  Top 0.254: R26.2 39.22,60.6 R30.2 37.16,57.41 R13.2 | U1.25 31.22,50.79
  Top 0.305: U1.25 32.2,50.85 32.64,51.29 v32.64,55.69 | 37.74,54.99 37.34,55.39 v37.34,56.09 37.34,57.09 36.94,57.49
  Bottom 0.305: v32.64,55.69 33.04,56.09 v37.34,56.09
IO4/SDA  (via drill 0.3)
  Top 0.305: J2.4 9.82,53.19 v10.34,53.19 | v20.34,51.99 31.03,51.99 U1.26
  Bottom 0.305: v10.34,53.19 19.14,53.19 v20.34,51.99
IO5/SCL  (via drill 0.3)
  Top 0.305: v10.14,52.39 6.14,52.39 J2.3 | v17.84,52.39 18.24,52.79 27.14,52.79 30.28,55.93 U1.29
  Bottom 0.305: v10.14,52.39 v17.84,52.39
IO12/HMISO
  Top 0.305: U1.14 13.68,50.33 U2.2
IO13/HMOSI  (via drill 0.3)
  Top 0.305: U2.3 11.68,47.23 v12.14,47.69 | v17.64,47.69 17.64,49.29 U1.16
  Bottom 0.305: v12.14,47.69 v17.64,47.69
IO14/HSCK  (via drill 0.3)  (1 unrouted)
  Top 0.305: U1.13 11.57,52.12 v11.04,51.59 | v9.54,41.69 9.64,41.79 9.64,43.69
  Bottom 0.305: v11.04,51.59 9.54,50.09 v9.54,41.69
IO18  (via drill 0.3)  (1 unrouted)
  Top 0.305: U1.30 29.95,57.2 v26.44,53.69 | v31.34,42.69 31.84,42.69 33.44,41.09
  Bottom 0.305: v26.44,53.69 26.44,47.59 v31.34,42.69
IO19  (1 unrouted)
  Top 0.254: U1.31 32.86,58.47 35.14,56.19 35.14,49.19 37.24,47.09 37.24,41.09
IO21
  Top 0.305: U1.33 LED1.-
IO22/TX  (via drill 0.3)  (1 unrouted)
  Top 0.305: R18.2 6.93,15.4 6.14,16.19 6.14,20.99 6.99,21.84 K1.2 10.2,21.84 12.74,24.38 v12.74,46.59 | 31.14,64.79 30.14,64.79 28.54,63.19 28.54,57.49 24.64,53.59 v21.44,53.59
  Bottom 0.305: v12.74,46.59 12.84,46.69 18.9,46.69 21.44,49.23 v21.44,53.59
IO23/RX  (via drill 0.3)  (1 unrouted)
  Top 0.305: v18.74,24.19 18.74,21.29 17.22,19.77 K2.4 | 21.44,27.79 20.14,26.49 v18.84,26.49 17.14,28.19 v17.14,33.09 | R8.2 21.47,27.77 R17.1 | U1.37 30.24,66.09 27.94,63.79 27.94,57.89 24.44,54.39 v22.84,54.39
  Bottom 0.305: v18.74,24.19 18.84,24.29 v18.84,26.49 | v17.14,33.09 17.14,43.19 22.84,48.89 v22.84,54.39
IO25  (via drill 0.3)
  Top 0.305: U1.10 9.1,55.93 arc-90 v9.04,55.99 | v11.84,37.29 11.64,37.09 v11.64,29.59 | v11.64,29.59 11.64,27.69 | R11.1 19.72,27.89 v18.74,27.89 | v11.64,29.59 11.64,27.74 U2.14
  Bottom 0.305: v9.04,55.99 8.54,55.49 8.54,40.59 v11.84,37.29 | v11.84,37.29 | v18.74,27.89 17.04,29.59 v11.64,29.59
IO26  (via drill 0.3)  (1 unrouted)
  Top 0.305: U1.11 14.47,54.66 15.24,53.89 15.24,47.99 v17.39,45.84 18.44,44.79 18.44,42.73 R20.1
  Bottom 0.305: R44.2 6.57,29.12 8.94,31.49 13.84,31.49 16.59,34.24 16.59,44.94 17.44,45.79
IO27  (via drill 0.3)  (1 unrouted)
  Top 0.305: R19.1 17.74,41.87 17.74,44.49 14.64,47.59 14.64,52.99 14.24,53.39 U1.12 | v1.74,35.69 v8.24,35.69 | v14.24,37.39 18.24,41.39 18.24,41.49
  Bottom 0.305: R43.2 1.72,35.67 v1.74,35.69 | v8.24,35.69 12.54,35.69 v14.24,37.39
IO32  (via drill 0.3)
  Top 0.305: U1.8 R9.1 10.34,58.64 v10.34,59.69 | v7.34,41.59 7.68,41.93 U2.5
  Bottom 0.305: v10.34,59.69 9.88,59.69 7.34,57.15 v7.34,41.59
IO33  (via drill 0.3)
  Top 0.305: v1.94,41.29 5.24,41.29 v5.74,41.79 5.74,43.64 U2.6 | v6.44,56.19 7.45,57.2 U1.9
  Bottom 0.305: R34.2 1.82,41.17 v1.94,41.29 | v5.74,41.79 6.64,42.69 6.64,55.99 v6.44,56.19
IO34  (via drill 0.3)  (1 unrouted)
  Top 0.305: R42.2 v14.84,10.59 | v14.84,10.59 | v18.24,56.09 18.24,57.09 14.34,60.99 13.14,60.99
  Top 0.406: R45.1 R42.2
  Bottom 0.305: v14.84,10.59 15.64,9.79 18.34,9.79 33.04,24.49 33.04,53.05 30.3,55.79 18.54,55.79 v18.24,56.09
IO35  (via drill 0.3)
  Top 0.305: R41.1 v17.94,10.69 | v17.94,10.69 | U1.7 14.7,59.74 17.24,57.2 v17.24,55.29
  Top 0.406: R37.2 R41.1
  Bottom 0.305: v17.24,55.29 17.34,55.19 29.9,55.19 32.44,52.65 32.44,25.19 v17.94,10.69
ISET
  Top 0.406: U6.2 41.34,22.52 41.34,23.72 R29.2
N$1  (via drill 0.3)
  Top 0.305: K2.1 9.92,19.77 v13.54,23.39 | v19.74,23.39 19.74,22.02 R14.2
  Bottom 0.305: v13.54,23.39 v19.74,23.39
N$2
  Top 0.61: D3.A 33.31,14.66 D2.C
N$3
  Top 0.305: R3.1 6.68,23.49 K1.1
N$4  (1 unrouted)
  Top 0.61: R10.2 1.76,20.74 C6.2 1.77,18.16 2.04,17.89
N$5
  Top 0.305: LED1.+ 35.37,60.95 R27.1
N$6  (1 unrouted)
  Top 0.305: IC1.16 45.44,48.59
N$7
  Top 0.406: PWR.- R21.2
N$8
  Top 0.254: Q4.1 41.17,57.5 R25.2
N$9
  Top 0.254: R15.2 41.36,54.02 Q1.1
N$10  (1 unrouted)
  Top 0.254: R30.1 43.56,59.47 44.64,58.39 44.64,57.79
N$11  (1 unrouted)
  Top 0.406: 25.12,41.17 C38.1 23.83,43.81 Q2.1
N$12
  Top 0.406: Q5.1 30.25,39.59 R38.2
  Top 0.61: R38.2 R47.1
N$13  (1 unrouted)
  Top 0.406: R36.2 36.78,29.59 35.34,29.59 | C15.1 34.53,29.63 Q6.1
N$14  (1 unrouted)
  Top 0.406: Q7.1 38.7,37.89 R12.2 38.64,39.55 38.64,41.19
N$15
  Top 0.406: R33.1 32.62,24.75 D1.C 32.94,27.31 32.94,29.89 34.04,30.99 Q6.2 35.23,31.04 C15.2 35.44,31.25 R23.2 | R23.2 37.35,32.93 Q8.2 | R23.2 34.02,34.35 R32.2
N$16  (1 unrouted)
  Top 0.254: U7.5 40.09,9.34
  Top 0.305: 44.52,8.43 R24.2 | 40.09,9.34 40.44,8.99 42.24,8.99 42.84,8.39
  Top 0.406: C25.2 44.52,8.43
N$17
  Top 0.305: U7.1 37.24,7.51 R22.2
N$18
  Top 0.406: R36.1 37.8,31.05 38.84,32.09 38.84,33.34 Q8.1 | Q8.1 37.73,34.45 R23.1 | Q8.1 37.74,35.67 Q7.3
N$19
  Top 0.406: R56.2 | R56.2 R42.1
N$20
  Top 0.406: D4.C 32.26,45.39 R49.1 31.53,45.57 Q9.2 26.83,45.57 R39.2 25.21,45.42 C38.2 23.68,45.34 Q2.2 20.23,45.45 R48.2
N$21  (1 unrouted)
  Top 0.406: R57.2 21,13.69 19.54,13.69
N$22
  Bottom 0.305: U3.11 2.2,31.9 R43.1
N$23  (1 unrouted)
  Top 0.406: L2.P$2 23.14,32.49 23.94,31.69 25.94,31.69 | D7.A 27,31.65 27.94,32.59 27.94,34.88 U4.1
N$24
  Bottom 0.305: R44.1 4,30.64 U3.10
N$25
  Top 0.406: 29,37.32 R50.1 | 29.11,36.11 C52.2 | 29.12,34.71 R46.2
  Top 0.61: U4.3 29,37.32 | R50.1 29.11,36.11 | C52.2 29.12,34.71
N$26  (1 unrouted)
  Top 0.61: U4.6 25,34.13 25.24,33.89
N$27  (1 unrouted)
  Bottom 0.305: U3.16 1.85,38.25 R34.1 | RES.T 1.76,38.21 arc-90 1.84,38.29
N$28
  Bottom 0.61: U3.18 4.74,41.52 4.74,45.06 C12.2 4.91,46.82 R53.1
N$29
  Bottom 0.61: R53.2 4.95,49.93 C13.2 5,52.77 ANT2.D
N$31  (1 unrouted)
  Top 0.406: Q9.1 26.91,43.67 R39.1 26.68,41.5 R52.1 | Q5.3 27.35,40.58 26.54,41.39
N$36  (1 unrouted)
  Top 0.305: 22.94,24.99 IC2.3 IC2.2 | R2.1 25.07,23.06 24.14,23.99 24.14,25.09
RESET  (via drill 0.3)  (2 unrouted)
  Top 0.254: Q4.3 42.78,57.35 44.74,55.39 44.74,53.49 | U1.3 23.31,64.82 v23.34,64.79 | v38.64,65.29 38.69,65.24 C1.2 38.76,64 R28.2 41.62,62.51 42.54,61.59 v42.54,60.99 | v42.54,58.69 42.54,57.79 42.14,57.39
  Bottom 0.254: v23.34,64.79 23.84,65.29 v38.64,65.29 | v42.54,60.99 v42.54,58.69
RS485_A
  Top 0.406: IC2.6 22.89,18.47 R1.1 | R4.1 21.22,18.26 R1.1 | R1.1 22.68,16.84 R7.1 | R7.1 22.61,16.78 ESD1.2 | R54.2 22.66,13.67 R7.1
RS485_B  (1 unrouted)
  Top 0.406: IC2.7 24.16,18.31 R1.2 | R7.2 24.18,13.75 24.24,13.69 | R7.2 24.2,16.84 R1.2 | R1.2 25.6,18.26 ESD2.2 | R5.2 24.22,16.86 R7.2
RTS  (1 unrouted)
  Top 0.254: IC1.19 43.03,53.68 43.14,53.79 | R15.1 43.09,55.3 Q4.2
RX1  (via drill 0.3)  (1 unrouted)
  Top 0.305: K2.2 9.48,17.23 v13.74,21.49 | 25.44,24.99 v25.44,26.09 25.44,26.83 R8.1
  Bottom 0.305: v13.74,21.49 23.44,21.49 25.44,23.49 v25.44,26.09
RXD  (via drill 0.3)
  Top 0.305: IC1.21 42.03,51.4 v41.34,52.09 | v35.44,62.29 v35.43,62.28 U1.34
  Bottom 0.305: v41.34,52.09 40.94,52.49 40.94,59.75 38.4,62.29 v35.44,62.29
TX1  (2 unrouted)
  Top 0.305: K1.4 17.57,24.99 21.64,24.99 21.64,23.69 22.94,22.39 27.24,22.39 R6.2 | R18.1 14.64,19.64 14.64,22.99 16.04,24.39 16.94,24.39
TXD  (via drill 0.3)
  Top 0.305: U1.35 35.18,63.55 v35.24,63.49 | v42.24,52.49 42.53,52.2 IC1.20
  Bottom 0.305: v35.24,63.49 39,63.49 41.54,60.95 41.54,53.19 v42.24,52.49
VBAT+  (2 unrouted)
  Top 0.61: R40.2 32.54,5.87 SW2.3 | R24.1 48.94,11.15 J5.1 46.24,17.69 42.93,14.38 C22.1 39.35,14.38 38.75,14.98 U6.5
  Bottom 0.61: SW2.3 32.55,4.3 36.64,8.39 45.94,8.39 48.94,11.39 J5.1
VBAT-  (via drill 0.3)  (1 unrouted)
  Top 0.305: C25.1 41.92,5.97 R35.1 40.89,7.36 U7.3 41.04,7.99 40.64,8.39 40.14,8.39 39.14,9.39 U7.6 39.05,9.99 v38.04,9.99
  Bottom 0.406: v38.04,9.99 38.04,12.29 45.44,19.69 J5.2
VBAT_IN
  Top 0.61: SW2.2 33.92,3.32 R40.1 33.92,6.57 Q3.3 30.23,8.14 D8.A
VBUS
  Top 0.305: IC1.8 41.03,40.4 42.94,38.49 44.89,38.49 arc90 J3.1
  Top 0.406: U6.8 42.56,16.87 41.94,17.49 37.29,17.49 R16.1
  Top 0.61: Q3.1 35.14,10.24 D2.A 37.64,12.73 37.64,15.83 36.99,16.48 R16.1 36.99,18.66 C9.2 37.02,20.01 C23.1 37.07,20.78 U6.4 38.75,25.9 41.34,28.49 POWER.+
  pour Top (isolate 0.305, no thermals): 42.84,38.59 42.84,36.69 43.44,36.09 44.34,35.19 44.34,32.59 44.34,30.19 43.14,28.99 42.64,28.99 42.44,28.79 42.44,27.89 42.94,27.39 45.14,27.39 46.14,28.39 46.14,33.19 46.14,36.19 45.74,36.59 45.74,38.49 45.64,38.59
VCC  (via drill 0.3)  (2 unrouted)
  Top 0.406: R32.1 31.94,31.33 Q6.3 31.04,29.19 v31.04,29.09 | U2.13 9.68,26.93 8.74,25.99 6.35,25.99 R3.2 | R17.2 21.42,29.31 R11.2 18.64,30.49 v18.04,30.49 | 9.64,27.69 v9.64,29.99 10.74,31.09 10.74,47.09 8.54,49.29 8.54,49.39 | R9.2 7.02,58.47 3.74,55.19 3.74,50.79 5.11,49.42 J2.2
  Bottom 0.406: v31.04,29.09 30.95,29.18 C7.2 27.34,29.2 C4.2 25.74,29.22 C20.2 24.05,29.26 C21.2 20.97,29.26 19.71,30.52 U3.9 19.57,30.49 v18.04,30.49 10.14,30.49 v9.64,29.99
VDD
  Top 0.406: Q2.3 20.66,44.5 R48.1 21.72,42.43 C48.1 21.67,41.3 C47.1 | C47.1 19.44,37.37 L2.P$1 | U4.5 U4.4 24.33,37.99 21.74,37.99 21.74,39.53 C47.1
  pour Top (isolate 0.305, no thermals): 20.04,37.79 23.04,37.79 23.04,37.99 21.84,39.19 21.44,39.19
VIN  (via drill 0.36)
  Top 0.305: 30.41,18.36 30.54,18.49 31.04,18.49 | 31.04,18.49 31.85,19.3 U5.5 | U5.8 33.84,19.73 33.84,18.59 33.74,18.49 v33.34,18.49 31.04,18.49
  Top 0.406: C10.2 30.41,18.36 | D4.A 33.48,43.86 R49.2 30.95,44.62 Q9.3
  Top 0.61: Q3.2 29.6,10.24 D8.C 28.94,13.58 D3.C 30.22,15.62 C18.2 30.28,16.87 C10.2 33.21,18.36 v33.34,18.49 | D4.A 35.04,42.3 v35.04,37.89
  Bottom 0.61: v35.04,37.89 35.04,20.19 v33.34,18.49
  pour Top (isolate 0.305, no thermals): 31.74,19.29 31.94,19.29 32.44,18.79 32.54,18.79 33.14,18.79 33.74,19.39 33.94,19.39 33.94,18.59 33.94,18.29 33.74,18.09 33.54,17.89 30.54,17.89 30.54,18.49 31.34,19.29

### Text on the board
tPlace: ON | OFF
bPlace: www.makerfabs.com | 433MHz | 868MHz | 915MHz | RS485-LoRa Wireless Station V1.3 | (IO34) | (IO35) | 5V | GND | RS485_A | RS485_B
tNames: - | +
bNames: - | +